# Altium schematic sheet [5]Power_ports(DXL&Battery).SchDoc
size A
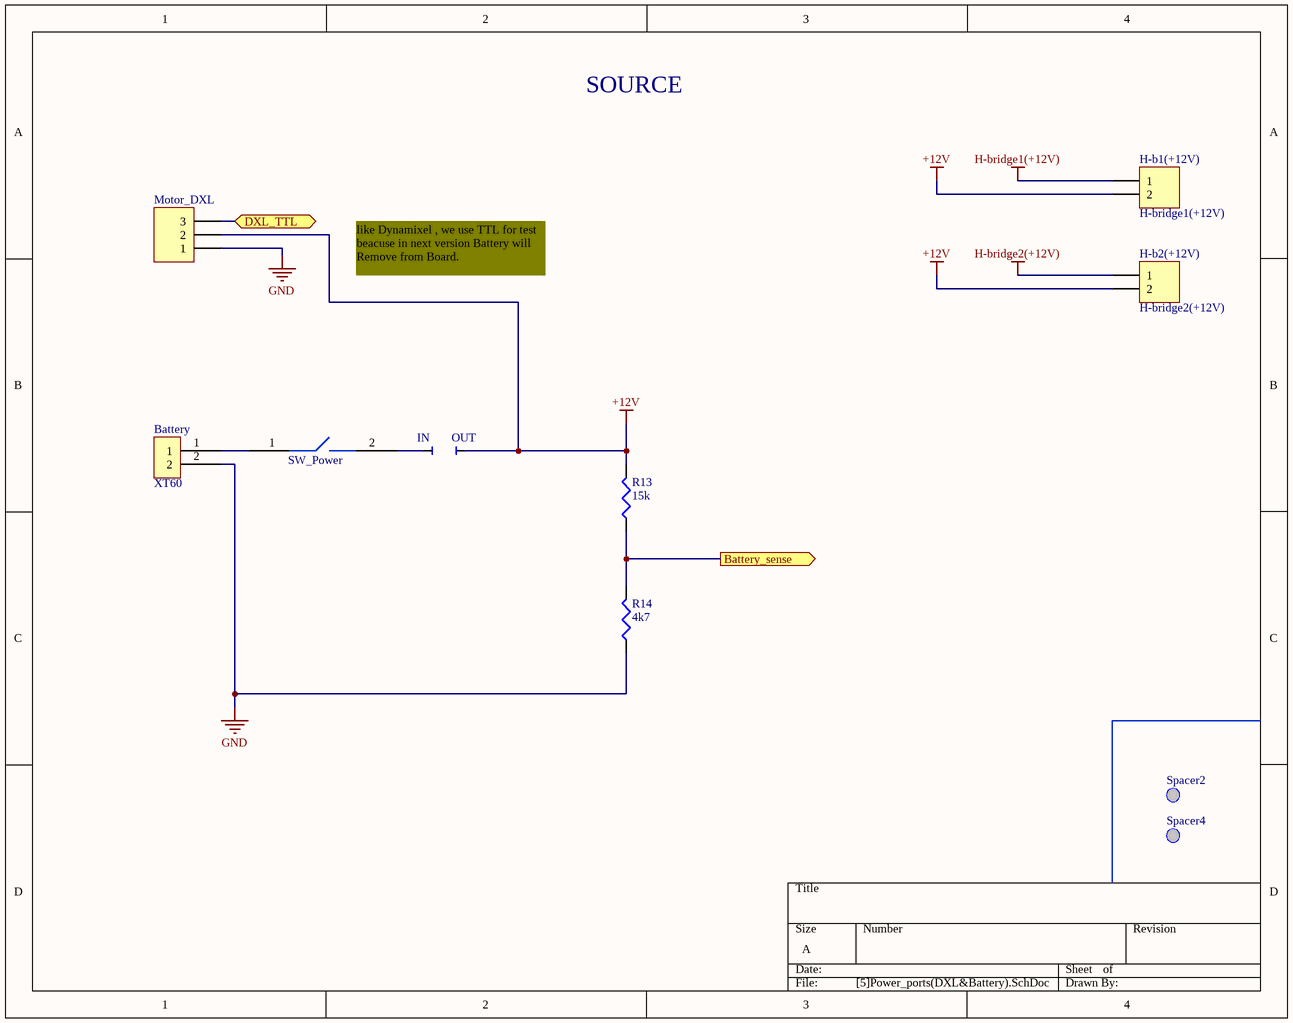
[diagram p0: [5]Power_ports(DXL&Battery).SchDoc]

## Parts
Battery  XT60  [XT60]
H-b1(+12V)  H-bridge1(+12V)  [HDR1X2]
H-b2(+12V)  H-bridge2(+12V)  [HDR1X2]
IN  Fuse Clip  [FUSH_LITTELFUSE_520]  (value not drawn)
Motor_DXL  Molex 22-03-5035  [Molex 22-3-5035]  (value not drawn)
OUT  Fuse Clip  [FUSH_LITTELFUSE_520]  (value not drawn)
R13  15k  [Res805]
R14  4k7  [Res805]
Spacer2  Spacer 12mm  [Spacer 12mm]  (value not drawn)
Spacer4  Spacer 12mm  [Spacer 12mm]  (value not drawn)
SW_Power  SW_KCD11  [SW_KCD11]  (value not drawn)

## Ports
Battery_sense (out), DXL_TTL (bidir)

## Nets
+12V: H-b1(+12V).2 H-b2(+12V).2 Motor_DXL.2 OUT.1 R13.2
GND: Battery.2 Motor_DXL.1 R14.1
H-bridge1(+12V): H-b1(+12V).1
H-bridge2(+12V): H-b2(+12V).1
Battery_sense: R13.1 R14.2 ; port Battery_sense
DXL_TTL: Motor_DXL.3 ; port DXL_TTL
NetBattery_1: Battery.1 SW_Power.1
NetIN_1: IN.1 SW_Power.2

## Notes on the sheet
- SOURCE
- like Dynamixel , we use TTL for test beacuse in next version Battery will Remove from Board.

## Library data of the parts
H-b1(+12V) H-b2(+12V) = Header 2: Header, 2-Pin; LatestRevisionDate: 17-Jul-2002; LatestRevisionNote: Re-released for DXP Platform.; Publisher: Altium Limited
IN OUT = FUSH_LITTELFUSE_52000001009: Part Description: Fuse Clip for 5mm Diameter Fuses; Table: Fuses; Part Number: FUSH_LITTELFUSE_52000001009; Component Kind: Standard; Component Type: Standard; Pin Count: 1; PackageDescription: Fuse Clip for 5mm Diameter Fuses; Family: Fuse Holder; Mounted: Yes; Socket: No; SMD: No; Manufacturer: LITTELFUSE; Manufacturer Part Number: 52000001009; ComponentHeight: 10mm; HelpURL: \\cern.ch\dfs\Applications\Altium\Datasheets\FUSH_LITTELFUSE_520.pdf; Author: CERN DEM JLC; CreateDate: 6/19/2013; LatestRevisionDate: 6/19/2013
R13 R14 = Res805
SW_Power = SW_KCD11: KCD11